# EAGLE design ChladniEagle2 (EAGLE 9.4.2)
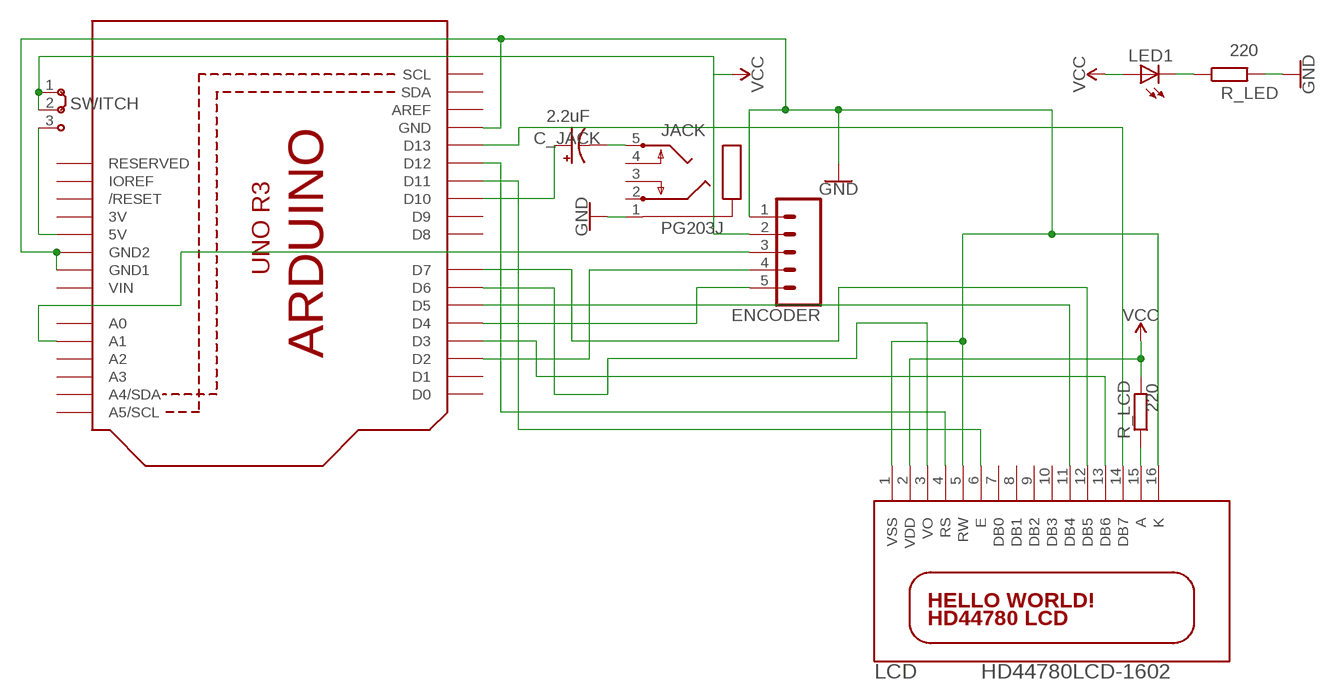
[diagram p0: schematic, sheet 1]

## Parts
C_JACK  CPOL-USE2,5-6E  [E2,5-6E]
ENCODER  CONN_05NO_SILK  [1X05_NO_SILK]
JACK  PG203J  [PG203J]
LCD  HD44780LCD-1602  [LCD1602]
LED1  LED5MM  [LED5MM]
R_LCD  R-EU_0204/7  [0204/7]
R_LED  R-EU_0204/7  [0204/7]
SWITCH  J2X2MM  [04C]
U1  ARDUINOR3-BPLACE  [ARDUINOR3-BPLACE]

## Nets
GND: ENCODER.1 JACK.1 LCD.1(VSS) LCD.5(RW) LCD.16(K) R_LED.2 U1.GND U1.GND1 U1.GND2
N$1: C_JACK.+ U1.D10
N$3: ENCODER.3 U1.A1
N$4: LED1.K(C) R_LED.1
N$5: SWITCH.3 U1.5V
N$7: C_JACK.- JACK.5
N$8: LCD.15(A) R_LCD.1
N$9: LCD.14(DB7) U1.D13
N$10: LCD.13(DB6) U1.D3
N$11: LCD.12(DB5) U1.D7
N$12: LCD.11(DB4) U1.D5
N$13: LCD.6(E) U1.D11
N$15: LCD.4(RS) U1.D12
N$16: LCD.3(VO) U1.D6
N$17: ENCODER.5 U1.D4
N$18: ENCODER.4 U1.D2
VCC: ENCODER.2 LCD.2(VDD) LED1.A R_LCD.2 SWITCH.1 SWITCH.2
Unconnected: JACK.2 JACK.3 JACK.4 LCD.7(DB0) LCD.8(DB1) LCD.9(DB2) LCD.10(DB3) U1.A0 U1.A2 U1.A3 U1.A4(A4/SDA) U1.A5(A5/SCL) U1.AREF U1.D0 U1.D1 U1.D8 U1.D9 U1.IOREF U1.RESERVED U1.RESET(/RESET) U1.SCL U1.SDA

## Power pins joined to a net without a drawn wire
3V: U1.3V
VIN: U1.VIN

## Library data of the parts
C_JACK = adafruit:CPOL-US: POLARIZED CAPACITOR, American symbol; CAPACITANCIA: 2.2uF
ENCODER = SparkFun-Connectors:CONN_05: Multi connection point. Often used as Generic Header-pin footprint for 0.1 inch spaced/style header connections On any of the 0.1 inch spaced packages, you can populate with these: Break Away Headers - Straight <https://www.sparkfun.com/products/116> (PRT-00116) Break Away Male Headers - Right Angle <https://www.sparkfun.com/products/553> (PRT-00553) Female Headers <https://www.sparkfun.com/products/115> (PRT-00115) Break Away Headers - Machine Pin <https://www.sparkfun.com/products/117> (PRT-00117) Break Away Female Headers - Swiss Machine Pin <https://www.sparkfun.com/products/743> (PRT-00743) For SCREWTERMINALS and SPRING TERMINALS visit here: Screw Terimnals on SparkFun.com <https://www.sparkfun.com/search/results?term=Screw+Terminals> (5mm/3.5mm/2.54mm spacing) This device is also useful as a general connection point to wire up your design to another part of your project. Our various solder wires solder well into these plated through hole pads. Hook-Up Wire - Assortment (Stranded, 22 AWG) <https://www.sparkfun.com/products/11375> (PRT-11375) Hook-Up Wire - Assortment (Solid Core, 22 AWG) <https://www.sparkfun.com/products/11367> (PRT-11367) View the entire wire category on our website here <https://www.sparkfun.com/categories/141> Special notes: Molex polarized connector foot print use with SKU : PRT-08231 with associated crimp pins and housings. 1MM SMD Version SKU: PRT-10208
JACK = con-hirschmann:PG203J: MIC/HEADPHONE JACK KS-S stereo microphone/headphone jack PG203JN (Schukat); OC_FARNELL: unknown; OC_NEWARK: unknown
LCD = adafruit:HD44780LCD: HD44780 LCD Standard character type LCDs, available in sizes from 8x1 to 40x4!
LED1 = adafruit:LED: LED OSRAM: - CHIPLED LG R971, LG N971, LY N971, LG Q971, LY Q971, LO R971, LY R971 LH N974, LH R974 LS Q976, LO Q976, LY Q976 LO Q996 - Hyper CHIPLED LW Q18S LB Q993, LB Q99A, LB R99A - SideLED LS A670, LO A670, LY A670, LG A670, LP A670 LB A673, LV A673, LT A673, LW A673 LH A674 LY A675 LS A676, LA A676, LO A676, LY A676, LW A676 LS A679, LY A679, LG A679 - Hyper Micro SIDELED® LS Y876, LA Y876, LO Y876, LY Y876 LT Y87S - SmartLED LW L88C, LW L88S LB L89C, LB L89S, LG L890 LS L89K, LO L89K, LY L89K LS L896, LA L896, LO L896, LY L896 - TOPLED LS T670, LO T670, LY T670, LG T670, LP T670 LSG T670, LSP T670, LSY T670, LOP T670, LYG T670 LG T671, LOG T671, LSG T671 LB T673, LV T673, LT T673, LW T673 LH T674 LS T676, LA T676, LO T676, LY T676, LB T676, LH T676, LSB T676, LW T676 LB T67C, LV T67C, LT T67C, LS T67K, LO T67K, LY T67K, LW E67C LS E67B, LA E67B, LO E67B, LY E67B, LB E67C, LV E67C, LT E67C LW T67C LS T679, LY T679, LG T679 LS T770, LO T770, LY T770, LG T770, LP T770 LB T773, LV T773, LT T773, LW T773 LH T774 LS E675, LA E675, LY E675, LS T675 LS T776, LA T776, LO T776, LY T776, LB T776 LHGB T686 LT T68C, LB T68C - Hyper Mini TOPLED® LB M676 - Mini TOPLED Santana® LG M470 LS M47K, LO M47K, LY M47K Source: http://www.osram.convergy.de/
R_LCD R_LED = rcl:R-EU_: RESISTOR, European symbol; RESISTENCIA: 220; SPICEPREFIX: R
SWITCH = jumper:J2: Jumper switch 2 x 2.5 mm
U1 = adafruit:ARDUINOR3: This is a new object for the new Arduino R3 - with extra pins that you may want to use (such as IOref, and duplicated A4/A5

## Board
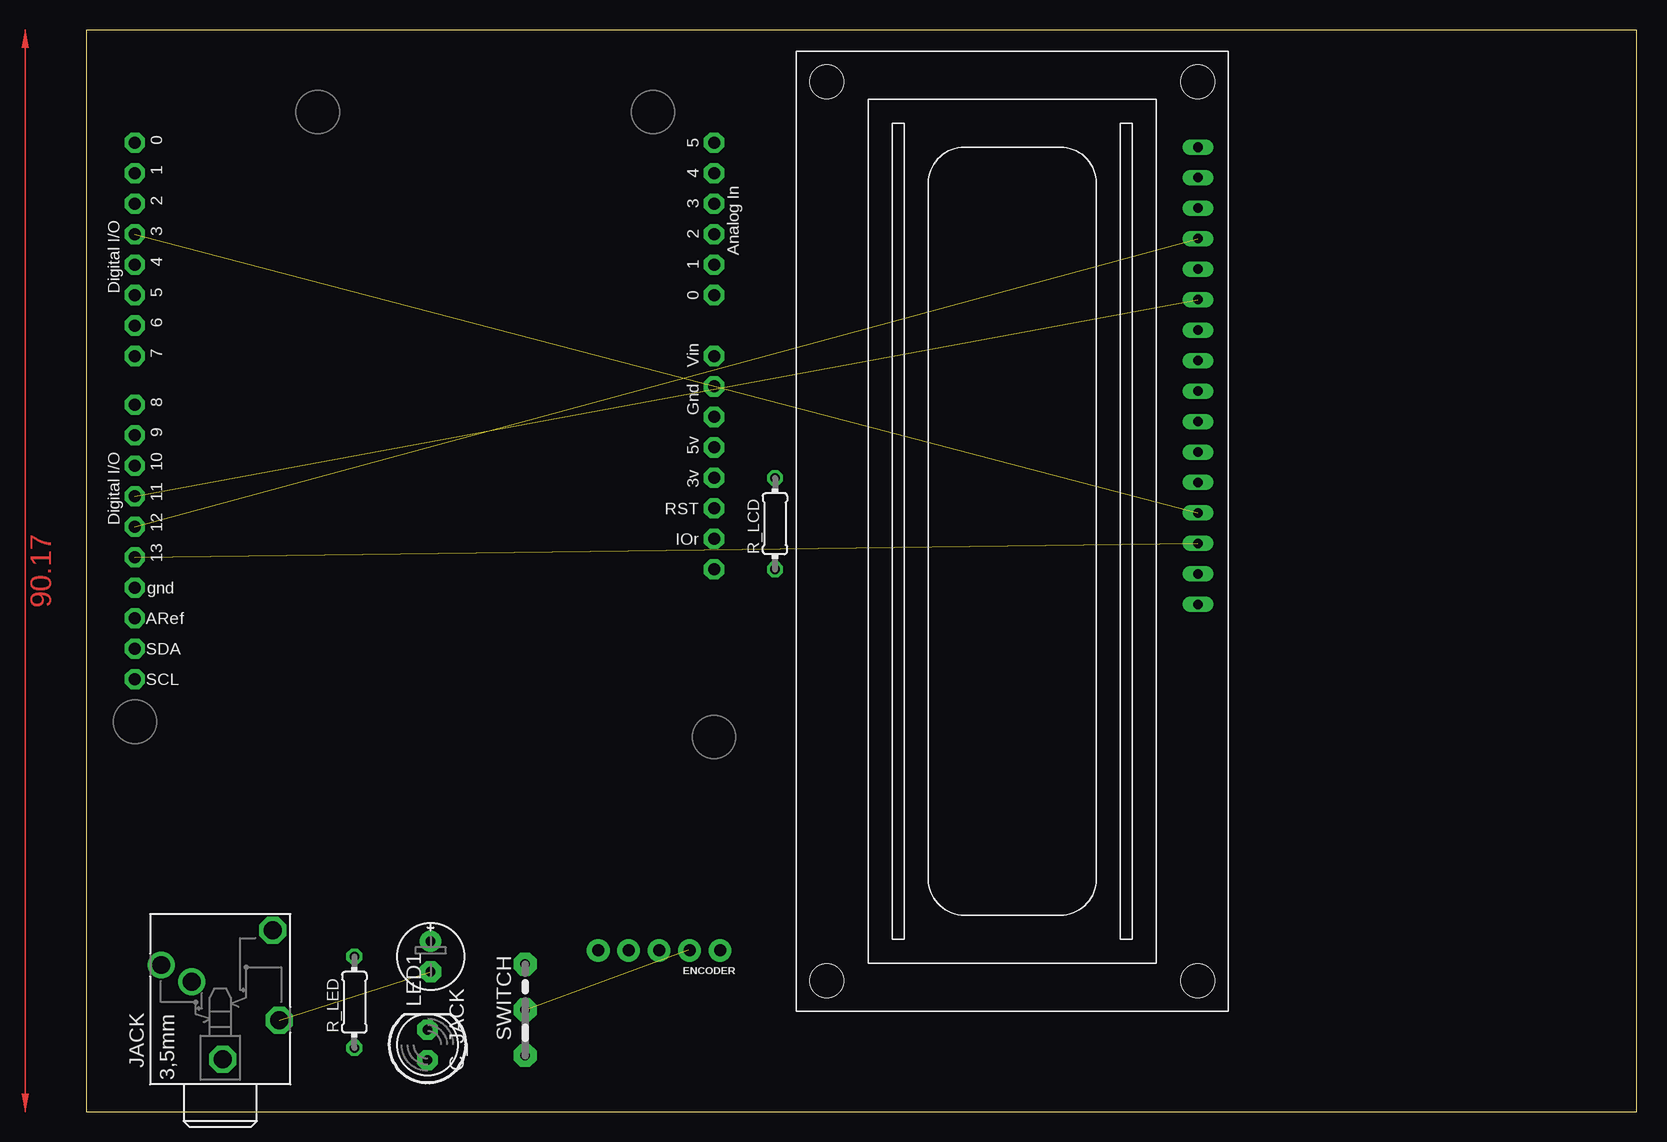
[diagram p1: board, top side]
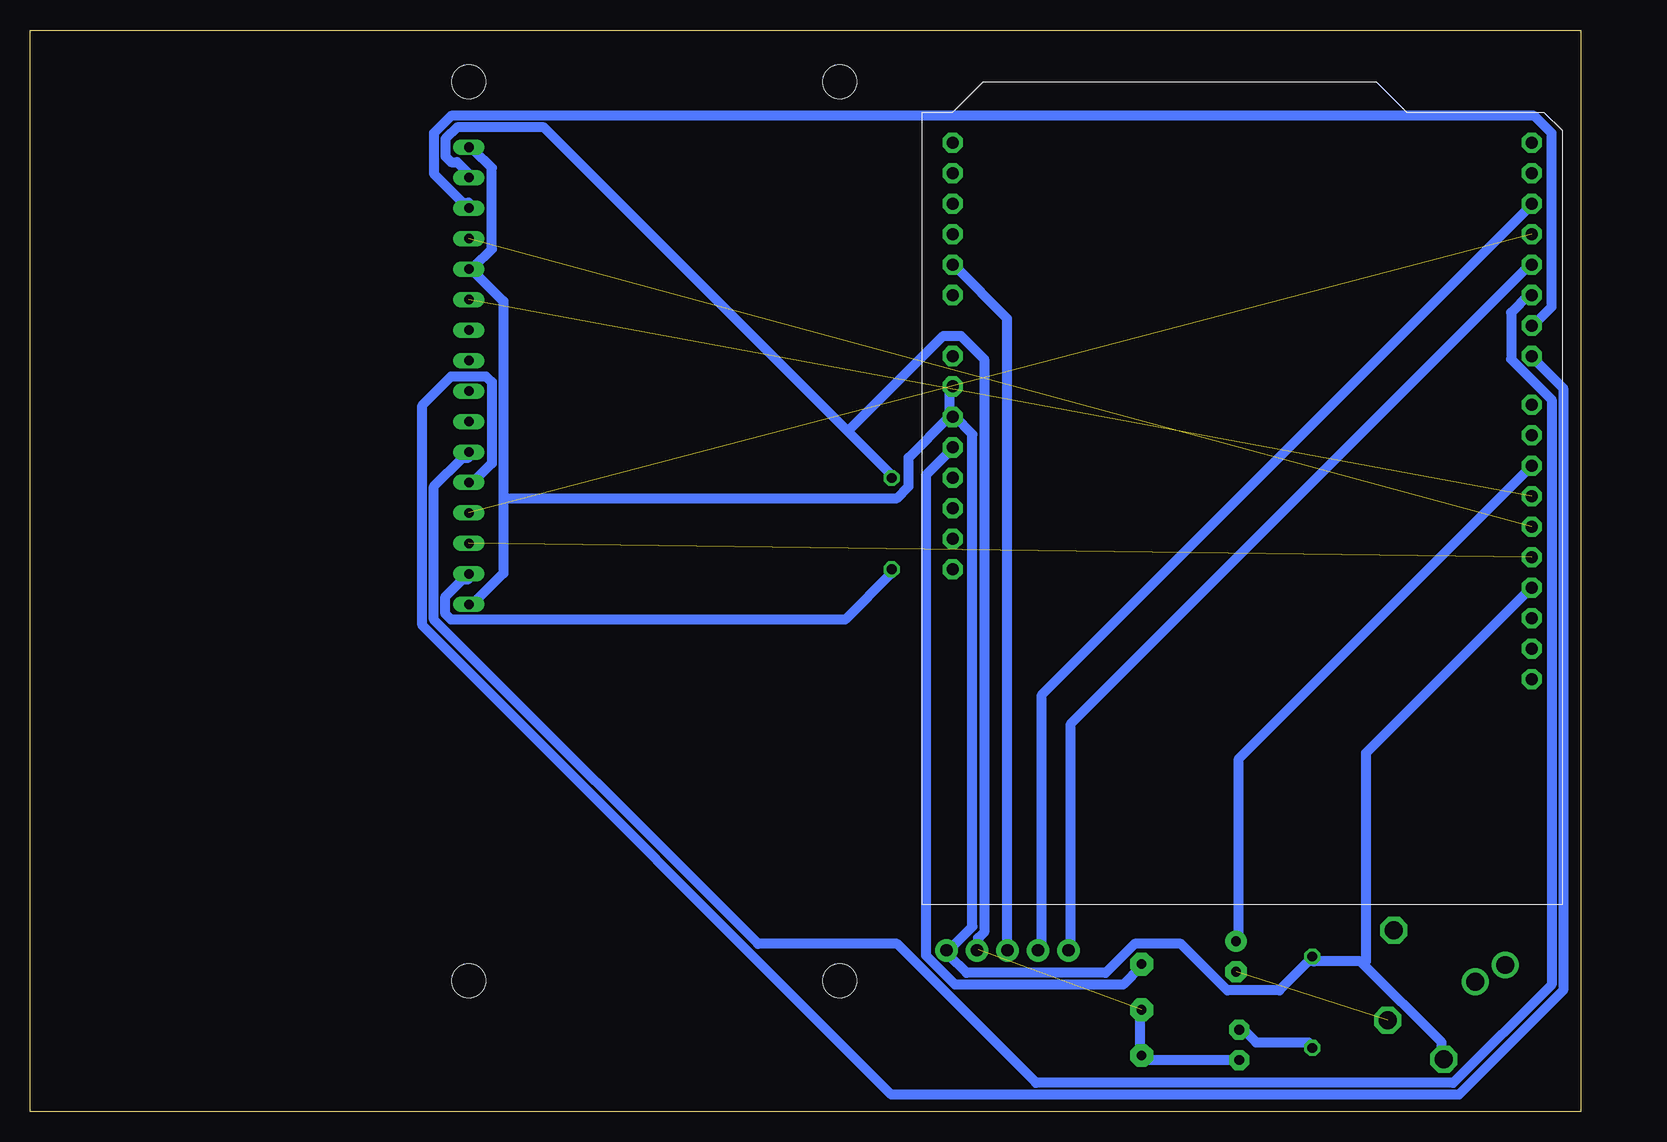
[diagram p2: board, bottom side, seen from below]

Size 129.21 x 90.16 mm. Coordinates in mm from the lower left corner, seen from the top.
Outline: 0,0 129.21,0 129.21,90.16 0,90.16 0,0
Copper layers (1*16): Top 0.035mm / dielectric 1.5mm / Bottom 0.035mm
Design rules "default *": minimum track width 32mil, minimum drill 0.35mm, track to track 6mil, track to pad 6mil, pad to pad 6mil, via to via 6mil, smd to smd 6mil, copper to edge 40mil, drill to drill 6mil, minimum pad ring 10mil, minimum via ring 8mil, stop-mask expansion 4mil, vias tented up to drill 0mil, thermal gap 10mil

### Footprints (pad centres in the part's own frame; a part is rotated, then mirrored left to right if it is on the bottom)
E2,5-6E = drill 0.813 pad 1.778: + -1.27,0 | drill 0.813 pad 1.778 octagon: - 1.27,0
1X05_NO_SILK = drill 1.016 pad 1.88: 1 0,0; 2 2.54,0; 3 5.08,0; 4 7.62,0; 5 10.16,0
PG203J = drill 1.499 octagon: 1 -5.004,-0.203; 4 5.74,-4.369; 5 -1.753,-4.902 | drill 1.499: 2 2.845,4.902; 3 1.448,2.388
LCD1602 = drill 0.8 long: 1 8,33.46; 2 10.54,33.46; 3 13.08,33.46; 4 15.62,33.46; 5 18.16,33.46; 6 20.7,33.46; 7 23.24,33.46; 8 25.78,33.46; 9 28.32,33.46; 10 30.86,33.46; 11 33.4,33.46; 12 35.94,33.46; 13 38.48,33.46; 14 41.02,33.46; 15 43.56,33.46; 16 46.1,33.46 | hole 2.8: 2.54,2.54; 2.54,33.46; 77.46,33.46; 77.46,2.54
LED5MM = drill 0.813 pad 1.676 octagon: A -1.27,0; K 1.27,0
0204/7 = drill 0.813 octagon: 1 -3.81,0; 2 3.81,0
04C = drill 0.813 pad 1.905 octagon: 1 -1.905,0; 2 1.905,0; 3 5.715,0
ARDUINOR3-BPLACE = drill 1 pad 1.676 octagon: 3V 35.56,2.54; 5V 38.1,2.54; A0 50.8,2.54; A1 53.34,2.54; A2 55.88,2.54; A3 58.42,2.54; A4 60.96,2.54; A5 63.5,2.54; AREF 23.876,50.8; D0 63.5,50.8; D1 60.96,50.8; D2 58.42,50.8; D3 55.88,50.8; D4 53.34,50.8; D5 50.8,50.8; D6 48.26,50.8; D7 45.72,50.8; D8 41.656,50.8; D9 39.116,50.8; D10 36.576,50.8; D11 34.036,50.8; D12 31.496,50.8; D13 28.956,50.8; GND 26.416,50.8; GND1 43.18,2.54; GND2 40.64,2.54; IOREF 30.48,2.54; RESERVED 27.94,2.54; RESET 33.02,2.54; SCL 18.796,50.8; SDA 21.336,50.8; VIN 45.72,2.54

### Placement (x,y rotation side)
C_JACK  28.7,12.95 270 top
ENCODER  52.83,13.46 180 top
JACK  11.18,9.4 90 top
LCD  59.18,88.39 270 top
LED1  28.45,5.59 90 top
R_LCD  57.4,49.02 90 top
R_LED  22.35,9.14 90 top
SWITCH  36.58,6.6 90 top
U1  54.86,17.27 90 top

### Tracks (layer width: path | path; a pad name or v marks a point on that pad's centre or on a via)
GND
  Bottom 0.813: 52.6,57.91 52.6,60.33 U1.GND1 | 89.76,51.16 89.76,67.56 92.18,69.98 LCD.5 92.18,70.46 90.73,71.91 90.73,78.66 92.18,80.11 LCD.1 | 89.76,51.16 89.76,44.88 92.18,42.47 LCD.16 | 52.6,57.91 55.98,54.53 55.98,52.12 56.95,51.16 89.76,51.16 | 52.6,57.91 U1.GND2 52.12,57.91 50.67,56.46 50.67,15.44 52.6,13.51 ENCODER.1 52.6,13.03 51.16,11.58 39.57,11.58 37.16,13.99 33.3,13.99 29.44,10.13 25.09,10.13 22.68,12.55 R_LED.2 22.2,12.55 18.34,12.55 18.1,12.31 | 18.1,12.31 11.58,5.79 11.58,4.83 JACK.1 | U1.GND 4.34,43.43 17.86,29.92 17.86,12.55 18.1,12.31
N$1
  Bottom 0.813: U1.D10 28.47,29.44 28.47,14.48 C_JACK.+
N$3
  Bottom 0.813: U1.A1 52.12,70.46 47.78,66.12 47.78,13.51 ENCODER.3
N$4
  Bottom 0.813: R_LED.1 22.68,5.79 27.03,5.79 27.99,6.76 LED1.K
N$5
  Bottom 0.813: U1.5V 52.6,55.02 54.53,53.09 54.53,13.03 52.12,10.62 38.12,10.62 36.68,12.06 SWITCH.3
N$7  (1 unrouted)
N$8
  Bottom 0.813: LCD.15 92.66,44.4 93.14,44.4 94.59,42.95 94.59,41.5 94.11,41.02 61.29,41.02 57.43,44.88 R_LCD.1
N$9  (1 unrouted)
N$10  (1 unrouted)
N$11
  Bottom 0.813: LCD.12 92.18,52.6 90.73,54.05 90.73,60.81 91.21,61.29 94.11,61.29 96.52,58.88 96.52,40.54 57.43,1.45 10.13,1.45 1.45,10.13 1.45,60.33 3.86,62.74 U1.D7
N$12
  Bottom 0.813: LCD.11 92.66,54.53 93.14,54.53 95.56,52.12 95.56,41.02 68.53,13.99 56.95,13.99 45.36,2.41 10.62,2.41 2.41,10.62 2.41,59.36 5.79,62.74 5.79,66.6 4.34,68.05 U1.D5
N$13  (1 unrouted)
N$15  (1 unrouted)
N$16
  Bottom 0.813: LCD.3 92.66,75.77 93.14,75.77 95.56,78.18 95.56,81.56 94.11,83.01 3.86,83.01 2.41,81.56 2.41,67.08 3.86,65.63 U1.D6
N$17
  Bottom 0.813: U1.D4 4.34,70.46 42.47,32.33 42.47,13.51 ENCODER.5
N$18
  Bottom 0.813: U1.D2 4.34,75.29 44.88,34.75 44.88,13.51 ENCODER.4
VCC  (1 unrouted)
  Bottom 0.813: 61.05,56.71 57.43,53.09 R_LCD.2 | 61.05,56.71 86.39,82.04 93.62,82.04 94.59,81.08 94.59,79.63 94.11,79.15 93.62,79.15 92.66,78.18 LCD.2 | 61.05,56.71 53.09,64.67 51.64,64.67 49.71,62.74 49.71,14.96 50.19,14.48 50.19,13.51 ENCODER.2 | LED1.A 28.47,4.34 36.2,4.34 SWITCH.1 36.68,4.83 36.68,8.2 SWITCH.2
(copper drawn outside any net)
  shapes: Top area x2